# Altium schematic sheet [03]-MPU6050.SchDoc
size A4; Organization: Indruino Co., Ltd; Address1: No. 1, Vo Van Ngan Street; Address2: Thu Duc District, HCMC; SheetNumber: 4; SheetTotal: 9
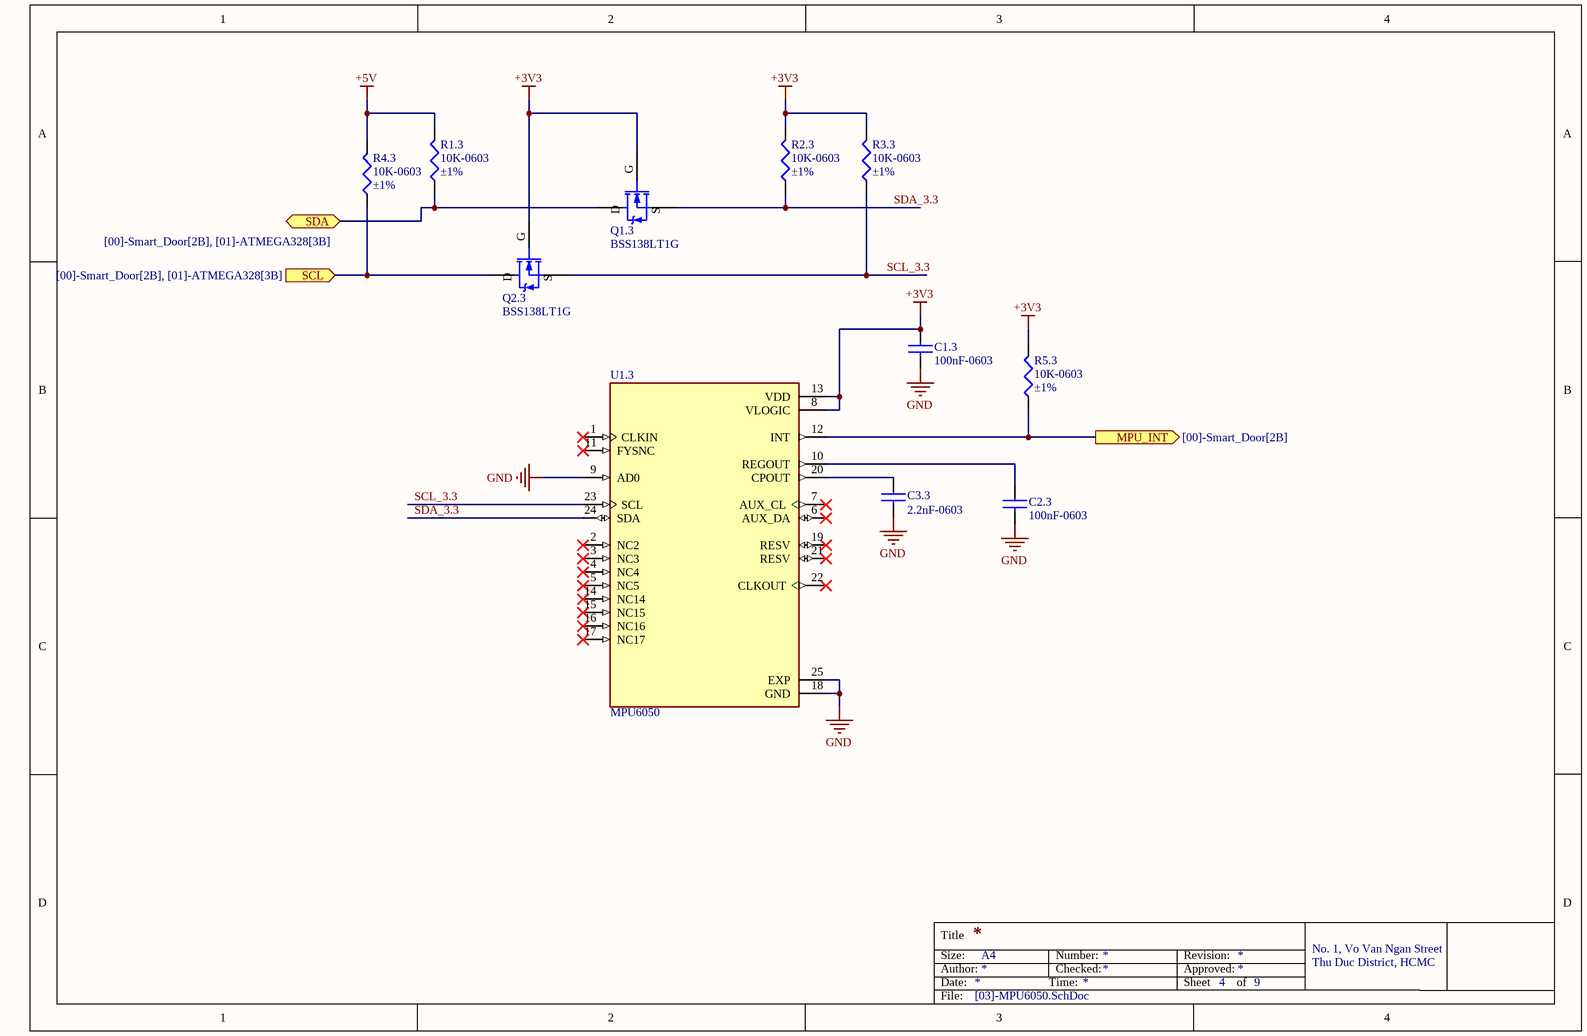
[diagram p0: [03]-MPU6050.SchDoc]

## Parts
C1.3  100nF-0603  [CAP0603]
C2.3  100nF-0603  [CAP0603]
C3.3  2.2nF-0603  [CAP0603]
Q1.3  BSS138LT1G  [SOT23]
Q2.3  BSS138LT1G  [SOT23]
R1.3  10K-0603  Tolerance: ±1%  [RES0603]
R2.3  10K-0603  Tolerance: ±1%  [RES0603]
R3.3  10K-0603  Tolerance: ±1%  [RES0603]
R4.3  10K-0603  Tolerance: ±1%  [RES0603]
R5.3  10K-0603  Tolerance: ±1%  [RES0603]
U1.3  MPU6050  [IC_MPU6050]

## Ports
MPU_INT (out, see [00]-Smart_Door[2B]), SCL (in, see [00]-Smart_Door[2B], [01]-ATMEGA328[3B]), SDA (bidir, see [00]-Smart_Door[2B], [01]-ATMEGA328[3B])

## Nets
+3V3: C1.3.1 Q1.3.1(G) Q2.3.1(G) R2.3.2 R3.3.2 R5.3.2 U1.3.8(VLOGIC) U1.3.13(VDD)
+5V: R1.3.2 R4.3.2
GND: C1.3.2 C2.3.2 C3.3.2 U1.3.9(AD0) U1.3.18(GND) U1.3.25(EXP)
MPU_INT: R5.3.1 U1.3.12(INT) ; port MPU_INT
SCL: Q2.3.3(D) R4.3.1 ; port SCL
SCL_3.3: Q2.3.2(S) R3.3.1 U1.3.23(SCL)
SDA: Q1.3.3(D) R1.3.1 ; port SDA
SDA_3.3: Q1.3.2(S) R2.3.1 U1.3.24(SDA)
NetC2.3_1: C2.3.1 U1.3.10(REGOUT)
NetC3.3_1: C3.3.1 U1.3.20(CPOUT)

Not connected (* = marked no-connect by the designer): U1.3 1(CLKIN)* 2(NC2)* 3(NC3)* 4(NC4)* 5(NC5)* 6(AUX_DA)* 7(AUX_CL)* 11(FYSNC)* 14(NC14)* 15(NC15)* 16(NC16)* 17(NC17)* 19(RESV)* 21(RESV)* 22(CLKOUT)*

## Notes on the sheet
- Title
- Size:
- Date:
- Author:
- A4
- Time:
- Number:
- Checked:
- Revision:
- Sheet
- Approved:
- of
- File:

## Library data of the parts
C1.3 C2.3 = CC0603KRX7R9BB104: CAP CER 0.1UF 50V X7R 0603; Manufacturer 1: Yageo; Category 1: Capacitors; Capacitance: 0.1µF; Tolerance: ±10%; Value: 100nF; Supplier 1: Digi-Key; Supplier Part Number 1: 311-1344-1-ND; Manufacturer Part Number 1: CC0603KRX7R9BB104; RoHS 1: RoHS Compliant; Description 1: CAP CER 0.1UF 50V X7R 0603; Stock 1: 4411645; Pricing 1: 1=0.1, 10=0.031, 100=0.014, 500=0.00998, 1000=0.00783 (USD); Packaging: Cut Tape (CT); Part Status: Active; Voltage - Rated: 50V; Temperature Coefficient: X7R; Operating Temperature: -55°C ~ 125°C; Features: -; Ratings: -; Applications: General Purpose; Failure Rate: -; Mounting Type: Surface Mount, MLCC; Package / Case: 0603 (1608 Metric); Size / Dimension: 0.063" L x 0.031" W (1.60mm x 0.80mm); Height - Seated (Max): -; Thickness (Max): 0.035" (0.90mm); Lead Spacing: -; Lead Style: -; ComponentLink1URL: http://www.yageo.com/documents/recent/UPY-GPHC_X7R_6.3V-to-50V_18.pdf; ComponentLink1Description: http://www.yageo.com/documents/recent/UPY-GPHC_X7R_6.3V-to-50V_18.pdf
C3.3 = CC0603KRX7R9BB222: Multilayer Ceramic Capacitors MLCC - SMD/SMT 2200PF 50V 10% 0603; Manufacturer: Yageo; Type: General Purpose and High Capacitance Surface Mount Ceramic Multilayer Capacitor; Voltage Rating DC: 50 VDC; Capacitance - nF: 2.2 nF; Capacitance - uF: 0.0022 uF; Class: Class 2; Dielectric: X7R; Value: 2.2nF; Supplier 1: Mouser; Manufacturer Part Number: CC0603KRX7R9BB222; RoHS: RoHS Compliant; Category: Multilayer Ceramic Capacitors MLCC - SMD/SMT; Stock 1: 167669; Pricing 1: 1=0.100, 10=0.090, 100=0.070, 1000=0.065, 4000=0.010, 8000=0.009 (USD); Capacitance: 2200 pF; Height: 0.8 mm; Length: 1.6 mm; Package / Case: 0603 (1608 metric); Packaging: Cut Tape; Product: General Type MLCCs; Series: CC; Termination Style: SMD/SMT; Tolerance: 10 %; Brand: Yageo; Case Code - in: 0603; Case Code - mm: 1608; Maximum Operating Temperature: + 125 C; Minimum Operating Temperature: - 55 C; Product Type: Ceramic Capacitors; Standard Pack Qty: 4000; Subcategory: Capacitors; Termination: Standard; RoHS - Mouser: Y; Minimum Order Quantity: 1; Reeling: True; ComponentLink1URL: https://www.mouser.com/datasheet/2/447/UPY-GPHC_X7R_6.3V-to-50V_18-1154002.pdf; ComponentLink1Description: https://www.mouser.com/datasheet/2/447/UPY-GPHC_X7R_6.3V-to-50V_18-1154002.pdf; Supplier Part Number 1: 603-C0603KRX7R9BB222; Width: 0.8 mm
Q1.3 Q2.3 = BSS138LT1G: MOSFET N-CH 50V 200MA SOT-23; Manufacturer: ON Semiconductor; FET Type: N-Channel; Current - Continuous Drain (Id) @ 25°C: 200mA (Ta); Drive Voltage (Max Rds On,  Min Rds On): 5V; Rds On (Max) @ Id, Vgs: 3.5 Ohm @ 200mA, 5V; Vgs(th) (Max) @ Id: 1.5V @ 1mA; Vgs (Max): ±20V; Power Dissipation (Max): 225mW (Ta); Supplier 1: Digi-Key; Manufacturer Part Number: BSS138LT1G; RoHS: RoHS Compliant; Category: Discrete Semiconductor Products; Stock 1: 0; Pricing 1: 1=0.31, 10=0.283, 100=0.1583, 500=0.08482, 1000=0.05768 (USD); Packaging: Cut Tape (CT); Part Status: Active; Technology: MOSFET (Metal Oxide); FET Feature: -; Operating Temperature: -55°C ~ 150°C (TJ); Mounting Type: Surface Mount; Supplier Device Package: SOT-23-3 (TO-236); Package / Case: TO-236-3, SC-59, SOT-23-3; ComponentLink1URL: http://www.onsemi.com/pub/Collateral/BSS138LT1-D.PDF; ComponentLink1Description: http://www.onsemi.com/pub/Collateral/BSS138LT1-D.PDF; Supplier Part Number 1: BSS138LT1GOSCT-ND
R1.3 R2.3 R3.3 R4.3 R5.3 = RC0603FR-0710KL: RES SMD 10K OHM 1% 1/10W 0603; Manufacturer: Yageo; Power (Watts): 0.1W, 1/10W; Temperature Coefficient: ±100ppm/°C; Supplier 1: Digi-Key; Manufacturer Part Number: RC0603FR-0710KL; RoHS: RoHS Compliant; Category: Resistors; Stock 1: 16545228; Pricing 1: 1=0.1, 10=0.015, 100=0.006, 1000=0.00268, 2500=0.00233 (USD); Packaging: Cut Tape (CT); Part Status: Active; Composition: Thick Film; Features: Moisture Resistant; Operating Temperature: -55°C ~ 155°C; Package / Case: 0603 (1608 Metric); Supplier Device Package: 0603; Size / Dimension: 0.063" L x 0.032" W (1.60mm x 0.80mm); Height - Seated (Max): 0.022" (0.55mm); Failure Rate: -; ComponentLink1URL: http://www.yageo.com/documents/recent/PYu-RC_Group_51_RoHS_L_7.pdf; ComponentLink1Description: http://www.yageo.com/documents/recent/PYu-RC_Group_51_RoHS_L_7.pdf; Supplier Part Number 1: 311-10.0KHRCT-ND; Value: 10K
U1.3 = MPU6050: Accelerometer, Gyroscope, 6 Axis Sensor IÂ²C Output; MF: TDK InvenSense; Price: None; Package: VFQFN-24 TDK InvenSense; Value: *; MP: MPU6050; Availability: Unavailable; SnapEDA_Link: https://www.snapeda.com/parts/MPU6050/TDK%20InvenSense/view-part/3605706/?ref=snap